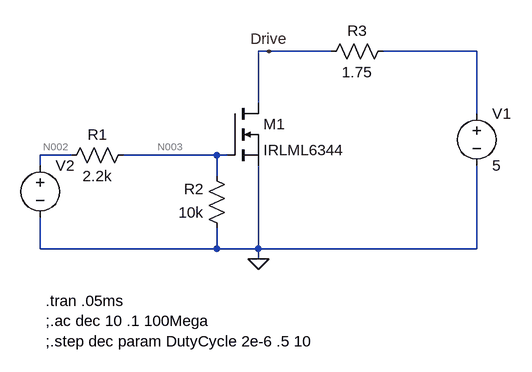
[diagram p0: schematic PC14-switchingCurrent.asc]
PC14-switchingCurrent.asc, the LTspice schematic file:
Version 4
SHEET 1 880 680
WIRE 400 176 384 176
WIRE 496 176 400 176
WIRE 720 176 576 176
WIRE 384 256 384 176
WIRE 720 272 720 176
WIRE 96 336 48 336
WIRE 320 336 176 336
WIRE 336 336 320 336
WIRE 48 352 48 336
WIRE 320 368 320 336
WIRE 48 480 48 432
WIRE 320 480 320 448
WIRE 320 480 48 480
WIRE 384 480 384 352
WIRE 384 480 320 480
WIRE 720 480 720 352
WIRE 720 480 384 480
WIRE 384 496 384 480
FLAG 384 496 0
FLAG 400 176 Drive
SYMBOL nmos 336 256 R0
SYMATTR InstName M1
SYMATTR Value IRLML6344
SYMBOL res 192 320 R90
WINDOW 0 0 56 VBottom 2
WINDOW 3 32 56 VTop 2
SYMATTR InstName R1
SYMATTR Value 2.2k
SYMBOL res 336 464 R180
WINDOW 0 36 76 Left 2
WINDOW 3 36 40 Left 2
SYMATTR InstName R2
SYMATTR Value 10k
SYMBOL voltage 720 256 R0
SYMATTR InstName V1
SYMATTR Value 5
SYMBOL voltage 48 336 R0
WINDOW 3 24 96 Invisible 2
SYMATTR InstName V2
SYMATTR Value PULSE(0 3.3 10us 75ns 50ns 25uS 1 1)
SYMATTR Value2 AC 3.3 0
SYMBOL res 480 192 R270
WINDOW 0 32 56 VTop 2
WINDOW 3 0 56 VBottom 2
SYMATTR InstName R3
SYMATTR Value 1.75
TEXT 56 560 Left 2 !.tran .05ms\n;.ac dec 10 .1 100Mega\n;.step dec param DutyCycle 2e-6 .5 10

The netlist it stands for:
* PC14-switchingCurrent.asc
M1 Drive N003 0 0 IRLML6344
R1 N003 N002 2.2k
R2 0 N003 10k
V1 N001 0 5
V2 N002 0 PULSE(0 3.3 10us 75ns 50ns 25uS 1 1) AC 3.3 0
R3 Drive N001 1.75
.model NMOS NMOS
.model PMOS PMOS
.lib standard.mos
.tran .05ms
;.ac dec 10 .1 100Mega
;.step dec param DutyCycle 2e-6 .5 10
.backanno
.end

* Results of the author's LTspice run, read from the files saved beside the schematic
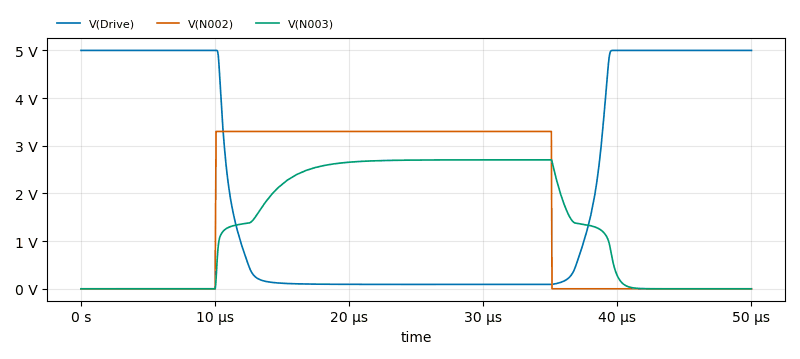
[diagram p1: Transient Analysis of PC14-switchingCurrent.asc, plotted from the saved traces]
* Transient Analysis, 1 run:
*   V(Drive): min 91.7 mV, max 5.001 V, average 2.329 V, rms 3.309 V, last 5 V
*   V(N002): min 0 V, max 3.3 V, average 1.654 V, rms 2.336 V, last 0 V
*   V(N003): min 0 V, max 2.705 V, average 1.356 V, rms 1.813 V, last 0 V